# EAGLE design as3320-Bandpass (EAGLE 9.5.2)

## Sheet 1 of 5
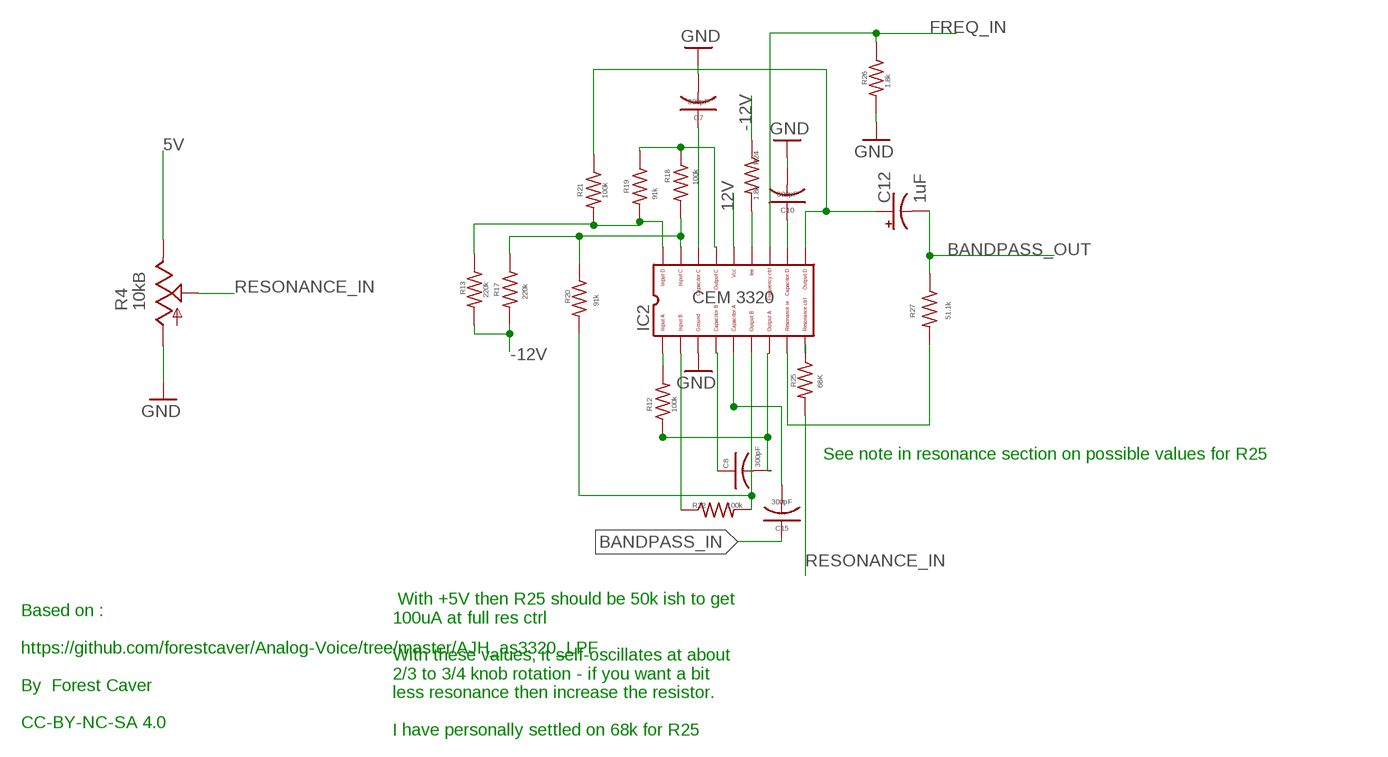
[diagram p0: schematic, sheet 1]

### Parts
C7  300pF  C-USC0603  [C0603]
C8  300pF  C-USC0603  [C0603]
C10  300pF  C-USC0603  [C0603]
C12  1uF  CPOL-USB  [PANASONIC_B]
C15  300pF  C-USC0603  [C0603]
IC2  CEM3320  [DIL18]
R4  10kB  POT_USVERTICAL  [ALPS_POT_VERTICAL]
R12  100k  R-US_R0603  [R0603]
R13  220k  R-US_R0603  [R0603]
R17  220k  R-US_R0603  [R0603]
R18  100k  R-US_R0603  [R0603]
R19  91k  R-US_R0603  [R0603]
R20  91k  R-US_R0603  [R0603]
R21  100k  R-US_R0603  [R0603]
R22  100k  R-US_R0603  [R0603]
R24  1.8k  R-US_R0603  [R0603]
R25  68K  R-US_R0603  [R0603]
R26  1.8k  R-US_R0603  [R0603]
R27  51.1k  R-US_R0603  [R0603]

### Nets
5V [power]: R4.P$1(E) ; also sheet 4
12V [power]: IC2.14 ; also sheet 2,3
-12V [power]: R13.2 R17.2 R24.1 ; also sheet 2,3
BANDPASS_IN: C15.1 ; also sheet 3
BANDPASS_OUT: C12.- R27.1 ; also sheet 3
FREQ_IN: IC2.12 R26.1 ; also sheet 3
GND [power]: C7.2 C10.2 IC2.3 R4.P$3(A) R26.2 ; also sheet 2,3,4
N$2: IC2.17 R17.1 R18.2 R20.1
N$14: IC2.15 R18.1 R19.1
N$16: IC2.18 R13.1 R19.2 R21.2
N$17 [nearfilter]: C12.+ IC2.10 R21.1
N$19: C15.2 IC2.5
N$23: C8.2 IC2.7 R12.1
N$24: C8.1 IC2.4
N$25: IC2.2 R22.1
N$26: IC2.6 R20.2 R22.2
N$27: IC2.1 R12.2
N$40: C7.1 IC2.16
N$43 [nearfilter]: C10.1 IC2.11
N$44 [nearfilter]: IC2.9 R25.1
N$51 [nearfilter]: IC2.8 R27.2
N$54 [nearfilter]: IC2.13 R24.2
RESONANCE_IN: R4.P$2(S) R25.2

### Notes on the sheet
- See note in resonance section on possible values for R25
- Based on :
  
  https://github.com/forestcaver/Analog-Voice/tree/master/AJH_as3320_LPF
  
  By  Forest Caver
  
  CC-BY-NC-SA 4.0
- With +5V then R25 should be 50k ish to get
  100uA at full res ctrl
  
  With these values, it self-oscillates at about
  2/3 to 3/4 knob rotation - if you want a bit
  less resonance then increase the resistor.
  
  I have personally settled on 68k for R25

## Sheet 2 of 5
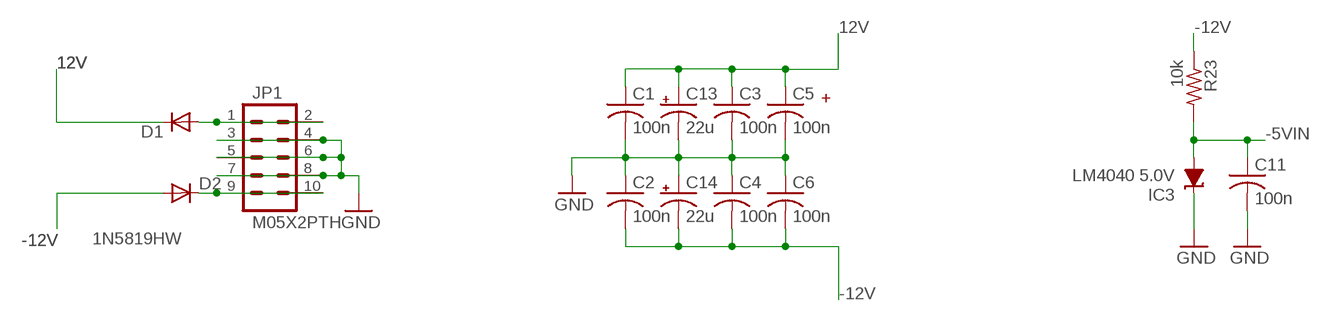
[diagram p1: schematic, sheet 2]

### Parts
C1  100n  C-USC0603  [C0603]
C2  100n  C-USC0603  [C0603]
C3  100n  C-USC0603  [C0603]
C4  100n  C-USC0603  [C0603]
C5  100n  C-USC0603  [C0603]
C6  100n  C-USC0603  [C0603]
C11  100n  C-USC0603  [C0603]
C13  22u  CPOL-USB  [PANASONIC_B]
C14  22u  CPOL-USB  [PANASONIC_B]
D1  1N5819HW  DIODE-SOD123  [SOD123]
D2  1N5819HW  DIODE-SOD123  [SOD123]
IC3  LM4040 5.0V  LM4041C12DBZ  [DBZ_R-PDSO-G3]
JP1  M05X2PTH  [AVR_ICSP]
R23  10k  R-US_R0603  [R0603]

### Nets
12V [power]: C1.1 C3.1 C5.1 C13.+ D1.C ; also sheet 1,3
-5VIN [power]: C11.1 IC3.2(A) R23.2 ; also sheet 4
-12V [power]: C2.2 C4.2 C6.2 C14.- D2.A R23.1 ; also sheet 1,3
GND [power]: C1.2 C2.1 C3.2 C4.1 C5.2 C6.1 C11.2 C13.- C14.+ IC3.1(C) JP1.3 JP1.4 JP1.5 JP1.6 JP1.7 JP1.8 ; also sheet 1,3,4
N$6: D1.A JP1.1 JP1.2
N$20: D2.C JP1.9 JP1.10

### Notes on the sheet
- +

## Sheet 3 of 5
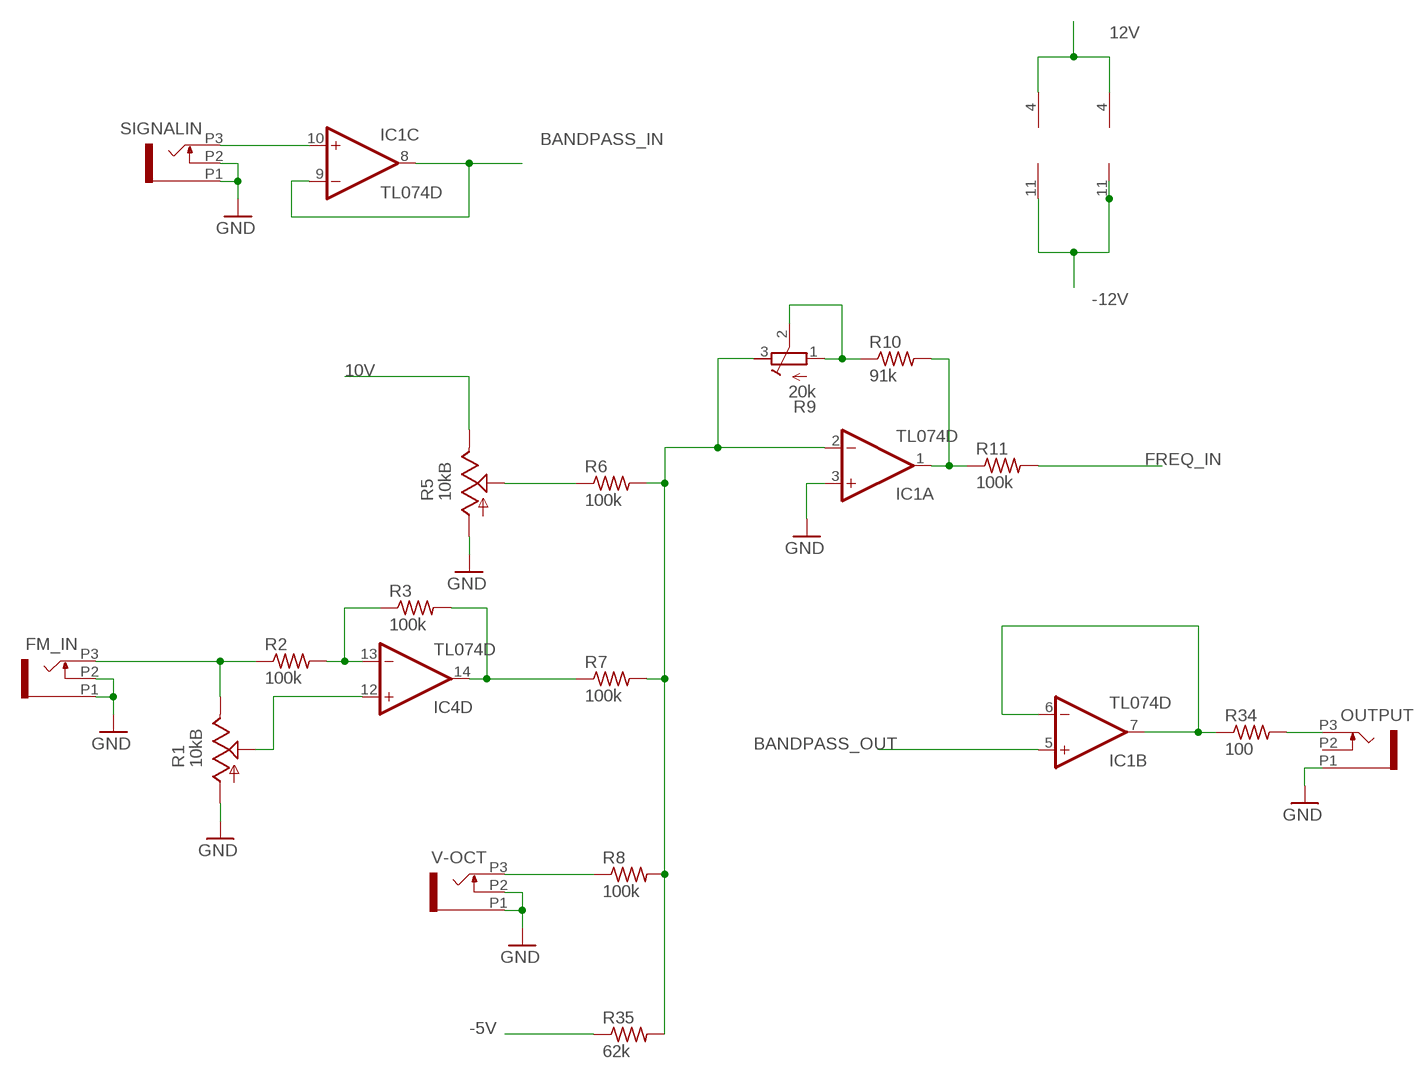
[diagram p2: schematic, sheet 3]

### Parts
FM_IN  PJ301_THONKICONN6  [WQP_PJ_301M6]
IC1  TL074D  [SO14]
IC4  TL074D  [SO14]
OUTPUT  PJ301_THONKICONN6  [WQP_PJ_301M6]
R1  10kB  POT_USVERTICAL  [ALPS_POT_VERTICAL]
R2  100k  R-US_R0603  [R0603]
R3  100k  R-US_R0603  [R0603]
R5  10kB  POT_USVERTICAL  [ALPS_POT_VERTICAL]
R6  100k  R-US_R0603  [R0603]
R7  100k  R-US_R0603  [R0603]
R8  100k  R-US_R0603  [R0603]
R9  20k  R-TRIMM3296X  [RTRIM3296X]
R10  91k  R-US_R0603  [R0603]
R11  100k  R-US_R0603  [R0603]
R34  100  R-US_R0603  [R0603]
R35  62k  R-US_R0603  [R0603]
SIGNALIN  PJ301_THONKICONN6  [WQP_PJ_301M6]
V-OCT  PJ301_THONKICONN6  [WQP_PJ_301M6]

### Nets
10V [power]: R5.P$1(E) ; also sheet 4
12V [power]: IC1.4(P:V+) IC4.4(P:V+) ; also sheet 1,2
-5V [power]: R35.1 ; also sheet 4
-12V [power]: IC1.11(P:V-) IC4.11(P:V-) ; also sheet 1,2
BANDPASS_IN: IC1.8(C:OUT) IC1.9(C:-IN) ; also sheet 1
BANDPASS_OUT: IC1.5(B:+IN) ; also sheet 1
FREQ_IN: R11.2 ; also sheet 1
GND [power]: FM_IN.P1 FM_IN.P2 IC1.3(A:+IN) OUTPUT.P1 R1.P$3(A) R5.P$3(A) SIGNALIN.P1 SIGNALIN.P2 V-OCT.P1 V-OCT.P2 ; also sheet 1,2,4
N$1: IC1.6(B:-IN) IC1.7(B:OUT) R34.1
N$3: IC4.12(D:+IN) R1.P$2(S)
N$4: R5.P$2(S) R6.1
N$5: IC4.13(D:-IN) R2.2 R3.1
N$7: IC1.2(A:-IN) R6.2 R7.2 R8.2 R9.3(A) R35.2
N$8: IC1.1(A:OUT) R10.2 R11.1
N$9: IC1.10(C:+IN) SIGNALIN.P3
N$10: R8.1 V-OCT.P3
N$11: OUTPUT.P3 R34.2
N$12: IC4.14(D:OUT) R3.2 R7.1
N$55: R9.1(E) R9.2(S) R10.1
N$82: FM_IN.P3 R1.P$1(E) R2.1
Unconnected: IC1.12(D:+IN) IC1.13(D:-IN) IC1.14(D:OUT) OUTPUT.P2

## Sheet 4 of 5: Ref
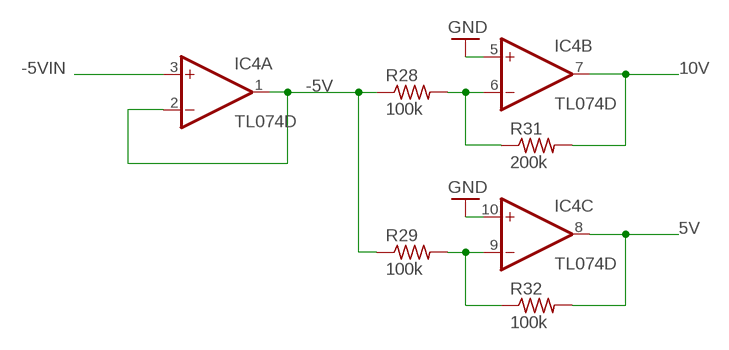
[diagram p3: schematic, sheet 4]

### Parts
R28  100k  R-US_R0603  [R0603]
R29  100k  R-US_R0603  [R0603]
R31  200k  R-US_R0603  [R0603]
R32  100k  R-US_R0603  [R0603]

### Nets
5V [power]: IC4.8(C:OUT) R32.2 ; also sheet 1
10V [power]: IC4.7(B:OUT) R31.2 ; also sheet 3
-5V [power]: IC4.1(A:OUT) IC4.2(A:-IN) R28.1 R29.1 ; also sheet 3
-5VIN [power]: IC4.3(A:+IN) ; also sheet 2
GND [power]: IC4.5(B:+IN) IC4.10(C:+IN) ; also sheet 1,2,3
N$13: IC4.9(C:-IN) R29.2 R32.1
N$15: IC4.6(B:-IN) R28.2 R31.1

## Sheet 5 of 5: Summing

## Library data of the parts
C1-C6 C11 = rcl:C-US: CAPACITOR, American symbol
C7 C8 C10 C15 = rcl:C-US: CAPACITOR, American symbol; SPICEPREFIX: C
C12 = rcl:CPOL-US: POLARIZED CAPACITOR, American symbol; SPICEPREFIX: C
C13 C14 = rcl:CPOL-US: POLARIZED CAPACITOR, American symbol
D1 D2 = diode:DIODE-: DIODE
FM_IN OUTPUT SIGNALIN V-OCT = og-pj301_variations:PJ301_THONKICONN
IC1 IC4 = linear:TL074: OP AMP
IC2 = CEM:CEM3320: CEM 3330 VCF
IC3 = texas:LM4041: PRECISION MICROPOWER SHUNT VOLTAGE REFERENCE Source: http://focus.ti.com/lit/ds/slcs146e/slcs146e.pdf
JP1 = og-header:M05X2: Header 5x2 Standard 10-pin dual row 0.1" header. Commonly used with AVR-ISP. Use with Spark Fun Electronics SKU: PRT-00778
R1 R4 R5 = og-pots:POT_US
R2 R3 R6-R8 R10 R11 R23 R28 R29 R31 R32 R34 R35 = resistor:R-US_: RESISTOR, American symbol
R9 = rcl:R-TRIMM: Trimm resistor
R12 R13 R17-R22 R24-R27 = rcl:R-US_: RESISTOR, American symbol; SPICEPREFIX: R

## Net classes
0 default: width 0.152 mm
1 power: width 0.406 mm
2 nearfilter: width 0.152 mm

## Board
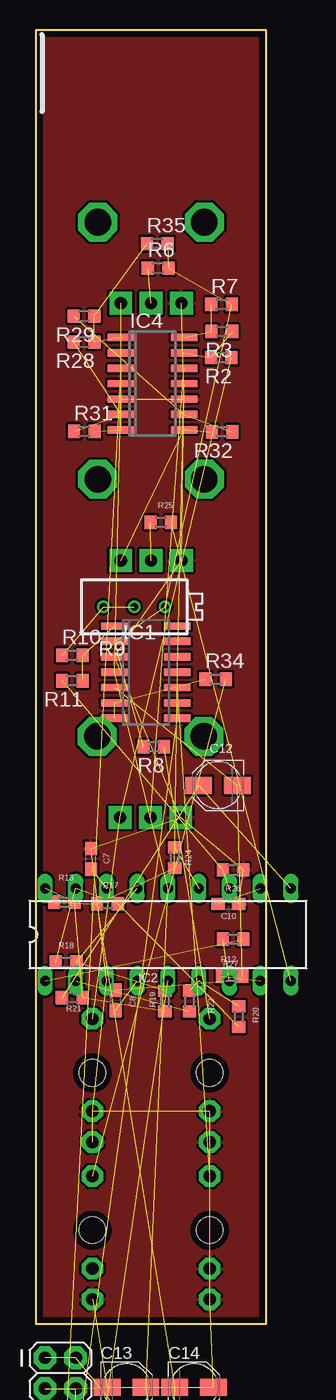
[diagram p4: board, top side]
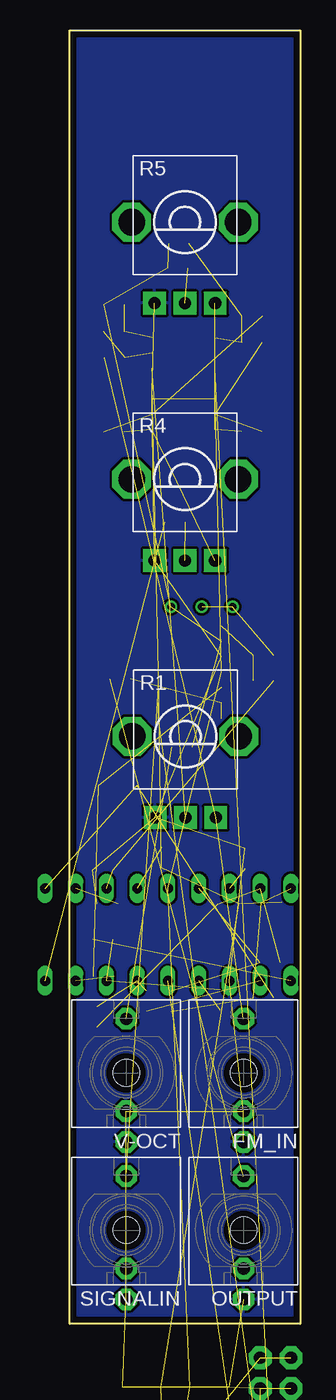
[diagram p5: board, bottom side, seen from below]

Size 19.03 x 106.76 mm. Coordinates in mm from the lower left corner, seen from the top.
Outline: 0,0 19.03,0 19.03,106.76 0,106.76 0,0
Copper layers (1*16): Top 0.035mm / dielectric 1.5mm / Bottom 0.035mm
Design rules "Mutable_PCBCart-Standard": minimum track width 8mil, minimum drill 0.4mm, track to track 8mil, track to pad 8mil, pad to pad 8mil, via to via 8mil, smd to smd 8mil, copper to edge 20mil, drill to drill 8mil, minimum pad ring 8mil, minimum via ring 10mil, stop-mask expansion 3mil, vias tented up to drill 25mil, thermal gap 8mil

### Footprints (pad centres in the part's own frame; a part is rotated, then mirrored left to right if it is on the bottom)
C0603 = smd 1.1 x 1: 1 -0.85,0; 2 0.85,0
PANASONIC_B = smd 2.2 x 1.4: + 1.6,0; - -1.6,0
SOD123 = smd 1.4 x 1.4: A 1.9,0; C -1.9,0
WQP_PJ_301M6 = drill 1.016 pad 1.778 octagon: P1 0,-5.715; P2 0,-3.175; P3 0,4.445 | hole 2.2: 0,0
SO14 = smd 0.6 x 2.2: 1 -3.81,-2.6; 2 -2.54,-2.6; 3 -1.27,-2.6; 4 0,-2.6; 5 1.27,-2.6; 6 2.54,-2.6; 7 3.81,-2.6; 8 3.81,2.6; 9 2.54,2.6; 10 1.27,2.6; 11 0,2.6; 12 -1.27,2.6; 13 -2.54,2.6; 14 -3.81,2.6
DIL18 = drill 0.813 long: 1 -10.16,-3.81; 2 -7.62,-3.81; 3 -5.08,-3.81; 4 -2.54,-3.81; 5 0,-3.81; 6 2.54,-3.81; 7 5.08,-3.81; 8 7.62,-3.81; 9 10.16,-3.81; 10 10.16,3.81; 11 7.62,3.81; 12 5.08,3.81; 13 2.54,3.81; 14 0,3.81; 15 -2.54,3.81; 16 -5.08,3.81; 17 -7.62,3.81; 18 -10.16,3.81
DBZ_R-PDSO-G3 = smd 0.7 x 1: 1 -0.95,-1.1; 2 0.95,-1.1; 3 0,1.1
AVR_ICSP = drill 1.016 pad 1.88 octagon: 1 -1.27,5.08; 2 1.27,5.08; 3 -1.27,2.54; 4 1.27,2.54; 5 -1.27,0; 6 1.27,0; 7 -1.27,-2.54; 8 1.27,-2.54; 9 -1.27,-5.08; 10 1.27,-5.08
ALPS_POT_VERTICAL = drill 1 pad 1.88 square: P$1 -2.5,6.7; P$2 0,6.7; P$3 2.5,6.7 | drill 2.2 pad 3.175 octagon: P$4 -4.4,0; P$5 4.4,0
R0603 = smd 1 x 1.1: 1 -0.85,0; 2 0.85,0
RTRIM3296X = drill 0.61: 1 0,-2.54; 2 0,0; 3 0,2.54

### Placement (x,y rotation side)
C1  16,-24.26 0 top  (outside the outline)
C2  0.13,-29.97 0 top  (outside the outline)
C3  5.59,-29.97 0 top  (outside the outline)
C4  11.05,-29.97 0 top  (outside the outline)
C5  16.51,-29.97 0 top  (outside the outline)
C6  0.13,-34.92 0 top  (outside the outline)
C7  4.57,38.39 90 top
C8  6.6,26.71 90 top
C10  15.91,34.67 0 top
C11  5.59,-34.92 0 top  (outside the outline)
C12  15.06,44.45 180 top
C13  7.49,-5.21 0 top  (outside the outline)
C14  13.08,-5.21 0 top  (outside the outline)
C15  0.13,-39.88 0 top  (outside the outline)
D1  13.08,-17.14 0 top  (outside the outline)
D2  1.27,-24.64 0 top  (outside the outline)
FM_IN  4.67,20.74 0 bottom
IC1  9.09,53.79 270 top
IC2  10.92,32.13 0 top
IC3  1.02,-18.03 0 top  (outside the outline)
IC4  9.65,77.6 270 top
JP1  2.03,-7.87 0 top
OUTPUT  4.67,7.75 0 bottom
R1  9.47,48.49 180 bottom
R2  15.32,79.75 180 top
R3  15.38,81.9 180 top
R4  9.53,69.71 180 bottom
R5  9.53,90.93 180 bottom
R6  10.11,87.13 0 top
R7  15.35,84.13 0 top
R8  9.75,47.63 180 top
R9  8.13,59.18 270 top
R10  3.02,55.17 0 top
R11  3.02,53.09 180 top
R12  16.3,31.75 0 top
R13  2.37,34.8 180 top
R17  5.93,34.67 180 top
R18  2.5,29.84 180 top
R19  10.67,26.63 270 top
R20  16.76,25.36 90 top
R21  3.01,26.92 0 top
R22  12.7,26.63 90 top
R23  11.56,-24.51 0 top  (outside the outline)
R24  11.47,38.48 90 top
R25  10.33,66.17 180 top
R26  16.3,37.47 0 top
R27  16.22,28.7 180 top
R28  3.98,81.03 180 top
R29  3.98,83.17 180 top
R31  4.02,73.65 0 top
R32  15.39,73.61 180 top
R34  14.86,53.21 0 top
R35  10.03,89.15 0 top
SIGNALIN  14.37,7.75 0 bottom
V-OCT  14.37,20.74 0 bottom

### Tracks (layer width: path | path; a pad name or v marks a point on that pad's centre or on a via)
5V  (2 unrouted)
10V  (2 unrouted)
12V  (7 unrouted)
-5V  (4 unrouted)
-5VIN  (3 unrouted)
-12V  (10 unrouted)
BANDPASS_IN  (2 unrouted)
BANDPASS_OUT  (2 unrouted)
FREQ_IN  (2 unrouted)
GND  (32 unrouted)
  pour Top: -0.89,107.7 19.43,107.7 20.07,107.06 20.32,106.81 20.32,-0.25 19.3,-1.27 -0.25,-1.27 -0.89,-0.64
  pour Bottom: -1.4,108.33 20.07,108.33 20.07,-0.64 -1.14,-0.64 -1.4,-0.38
N$1  (2 unrouted)
N$2  (3 unrouted)
N$3  (1 unrouted)
N$4  (1 unrouted)
N$5  (2 unrouted)
N$6  (2 unrouted)
N$7  (5 unrouted)
N$8  (2 unrouted)
N$9  (1 unrouted)
N$10  (1 unrouted)
N$11  (1 unrouted)
N$12  (2 unrouted)
N$13  (2 unrouted)
N$14  (2 unrouted)
N$15  (2 unrouted)
N$16  (3 unrouted)
N$17  (2 unrouted)
N$19  (1 unrouted)
N$20  (2 unrouted)
N$23  (2 unrouted)
N$24  (1 unrouted)
N$25  (1 unrouted)
N$26  (2 unrouted)
N$27  (1 unrouted)
N$40  (1 unrouted)
N$43  (1 unrouted)
N$44  (1 unrouted)
N$51  (1 unrouted)
N$54  (1 unrouted)
N$55  (2 unrouted)
N$82  (2 unrouted)
RESONANCE_IN  (1 unrouted)